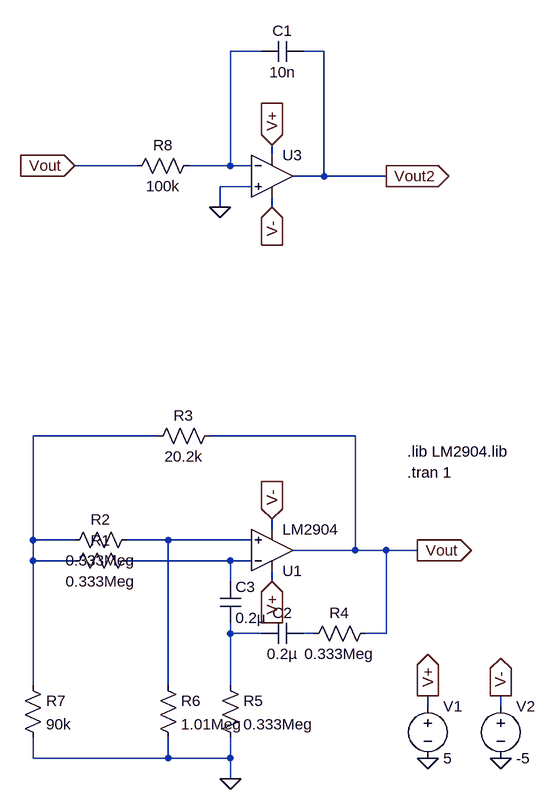
[diagram p0: schematic Draft23.asc]
Draft23.asc, the LTspice schematic file:
Version 4
SHEET 1 880 736
WIRE 368 -464 320 -464
WIRE 464 -464 432 -464
WIRE 384 -304 384 -320
WIRE 176 -288 80 -288
WIRE 320 -288 320 -464
WIRE 320 -288 256 -288
WIRE 352 -288 320 -288
WIRE 464 -272 464 -464
WIRE 464 -272 416 -272
WIRE 560 -272 464 -272
WIRE 352 -256 304 -256
WIRE 304 -224 304 -256
WIRE 384 -224 384 -240
WIRE 208 128 16 128
WIRE 512 128 288 128
WIRE 384 272 384 256
WIRE 16 288 16 128
WIRE 80 288 16 288
WIRE 224 288 160 288
WIRE 352 288 224 288
WIRE 512 304 512 128
WIRE 512 304 416 304
WIRE 560 304 512 304
WIRE 608 304 560 304
WIRE 16 320 16 288
WIRE 80 320 16 320
WIRE 320 320 160 320
WIRE 352 320 320 320
WIRE 320 352 320 320
WIRE 384 352 384 336
WIRE 320 432 320 416
WIRE 368 432 320 432
WIRE 448 432 432 432
WIRE 560 432 560 304
WIRE 560 432 528 432
WIRE 16 512 16 320
WIRE 224 512 224 288
WIRE 320 512 320 432
WIRE 624 544 624 528
WIRE 736 544 736 528
WIRE 16 624 16 592
WIRE 224 624 224 592
WIRE 224 624 16 624
WIRE 320 624 320 592
WIRE 320 624 224 624
WIRE 320 656 320 624
FLAG 320 656 0
FLAG 736 624 0
FLAG 624 624 0
FLAG 608 304 Vout
IOPIN 608 304 Out
FLAG 624 528 V+
IOPIN 624 528 Out
FLAG 736 528 V-
IOPIN 736 528 Out
FLAG 384 256 V-
IOPIN 384 256 In
FLAG 384 352 V+
IOPIN 384 352 In
FLAG 384 -320 V+
IOPIN 384 -320 In
FLAG 384 -224 V-
IOPIN 384 -224 In
FLAG 304 -224 0
FLAG 560 -272 Vout2
IOPIN 560 -272 Out
FLAG 80 -288 Vout
IOPIN 80 -288 In
SYMBOL res 176 304 R90
WINDOW 0 0 56 VBottom 2
WINDOW 3 32 56 VTop 2
SYMATTR InstName R1
SYMATTR Value 0.333Meg
SYMBOL res 176 272 R90
WINDOW 0 0 56 VBottom 2
WINDOW 3 32 56 VTop 2
SYMATTR InstName R2
SYMATTR Value 0.333Meg
SYMBOL res 192 144 R270
WINDOW 0 32 56 VTop 2
WINDOW 3 0 56 VBottom 2
SYMATTR InstName R3
SYMATTR Value 20.2k
SYMBOL res 432 448 R270
WINDOW 0 32 56 VTop 2
WINDOW 3 0 56 VBottom 2
SYMATTR InstName R4
SYMATTR Value 0.333Meg
SYMBOL res 304 496 R0
SYMATTR InstName R5
SYMATTR Value 0.333Meg
SYMBOL res 208 496 R0
SYMATTR InstName R6
SYMATTR Value 1.01Meg
SYMBOL res 0 496 R0
SYMATTR InstName R7
SYMATTR Value 90k
SYMBOL cap 432 416 R90
WINDOW 0 0 32 VBottom 2
WINDOW 3 32 32 VTop 2
SYMATTR InstName C2
SYMATTR Value 0.2µ
SYMBOL voltage 624 528 R0
SYMATTR InstName V1
SYMATTR Value 5
SYMBOL voltage 736 528 R0
SYMATTR InstName V2
SYMATTR Value -5
SYMBOL res 272 -304 R90
WINDOW 0 0 56 VBottom 2
WINDOW 3 32 56 VTop 2
SYMATTR InstName R8
SYMATTR Value 100k
SYMBOL cap 432 -480 R90
WINDOW 0 0 32 VBottom 2
WINDOW 3 32 32 VTop 2
SYMATTR InstName C1
SYMATTR Value 10n
SYMBOL cap 304 352 R0
SYMATTR InstName C3
SYMATTR Value 0.2µ
SYMBOL Opamps/UniversalOpamp2 384 -272 R0
SYMATTR InstName U3
SYMBOL Opamps/opamp2 384 368 M180
SYMATTR InstName U1
SYMATTR Value LM2904
TEXT 592 184 Left 2 !.tran 1
TEXT 592 152 Left 2 !.lib LM2904.lib

The netlist it stands for:
* Draft23.asc
R1 N004 N002 0.333Meg
R2 N003 N002 0.333Meg
R3 N002 Vout 20.2k
R4 N006 Vout 0.333Meg
R5 N005 0 0.333Meg
R6 N003 0 1.01Meg
R7 N002 0 90k
C2 N006 N005 0.2µ
V1 V+ 0 5
V2 V- 0 -5
R8 N001 Vout 100k
C1 Vout2 N001 10n
C3 N004 N005 0.2µ
XU3 0 N001 V+ V- Vout2 level.2 Avol=1Meg GBW=10Meg Slew=10Meg ilimit=25m rail=0 Vos=0 phimargin=45 en=0 enk=0 in=0 ink=0 Rin=500Meg  ; pins IN+ IN- V+ V- OUT
XU1 N003 N004 V+ V- Vout LM2904  ; pins In+ In- V+ V- OUT
.tran 1
.lib LM2904.lib
.lib UniversalOpamps2.sub
.backanno
.end